# EAGLE schematic esp32-Prototipo (EAGLE 8.2.2)
CNAME: Simulacare; CREVISION: 1.0.0; DESIGNER: Rinaldo; UNTITLED: Board ESP32
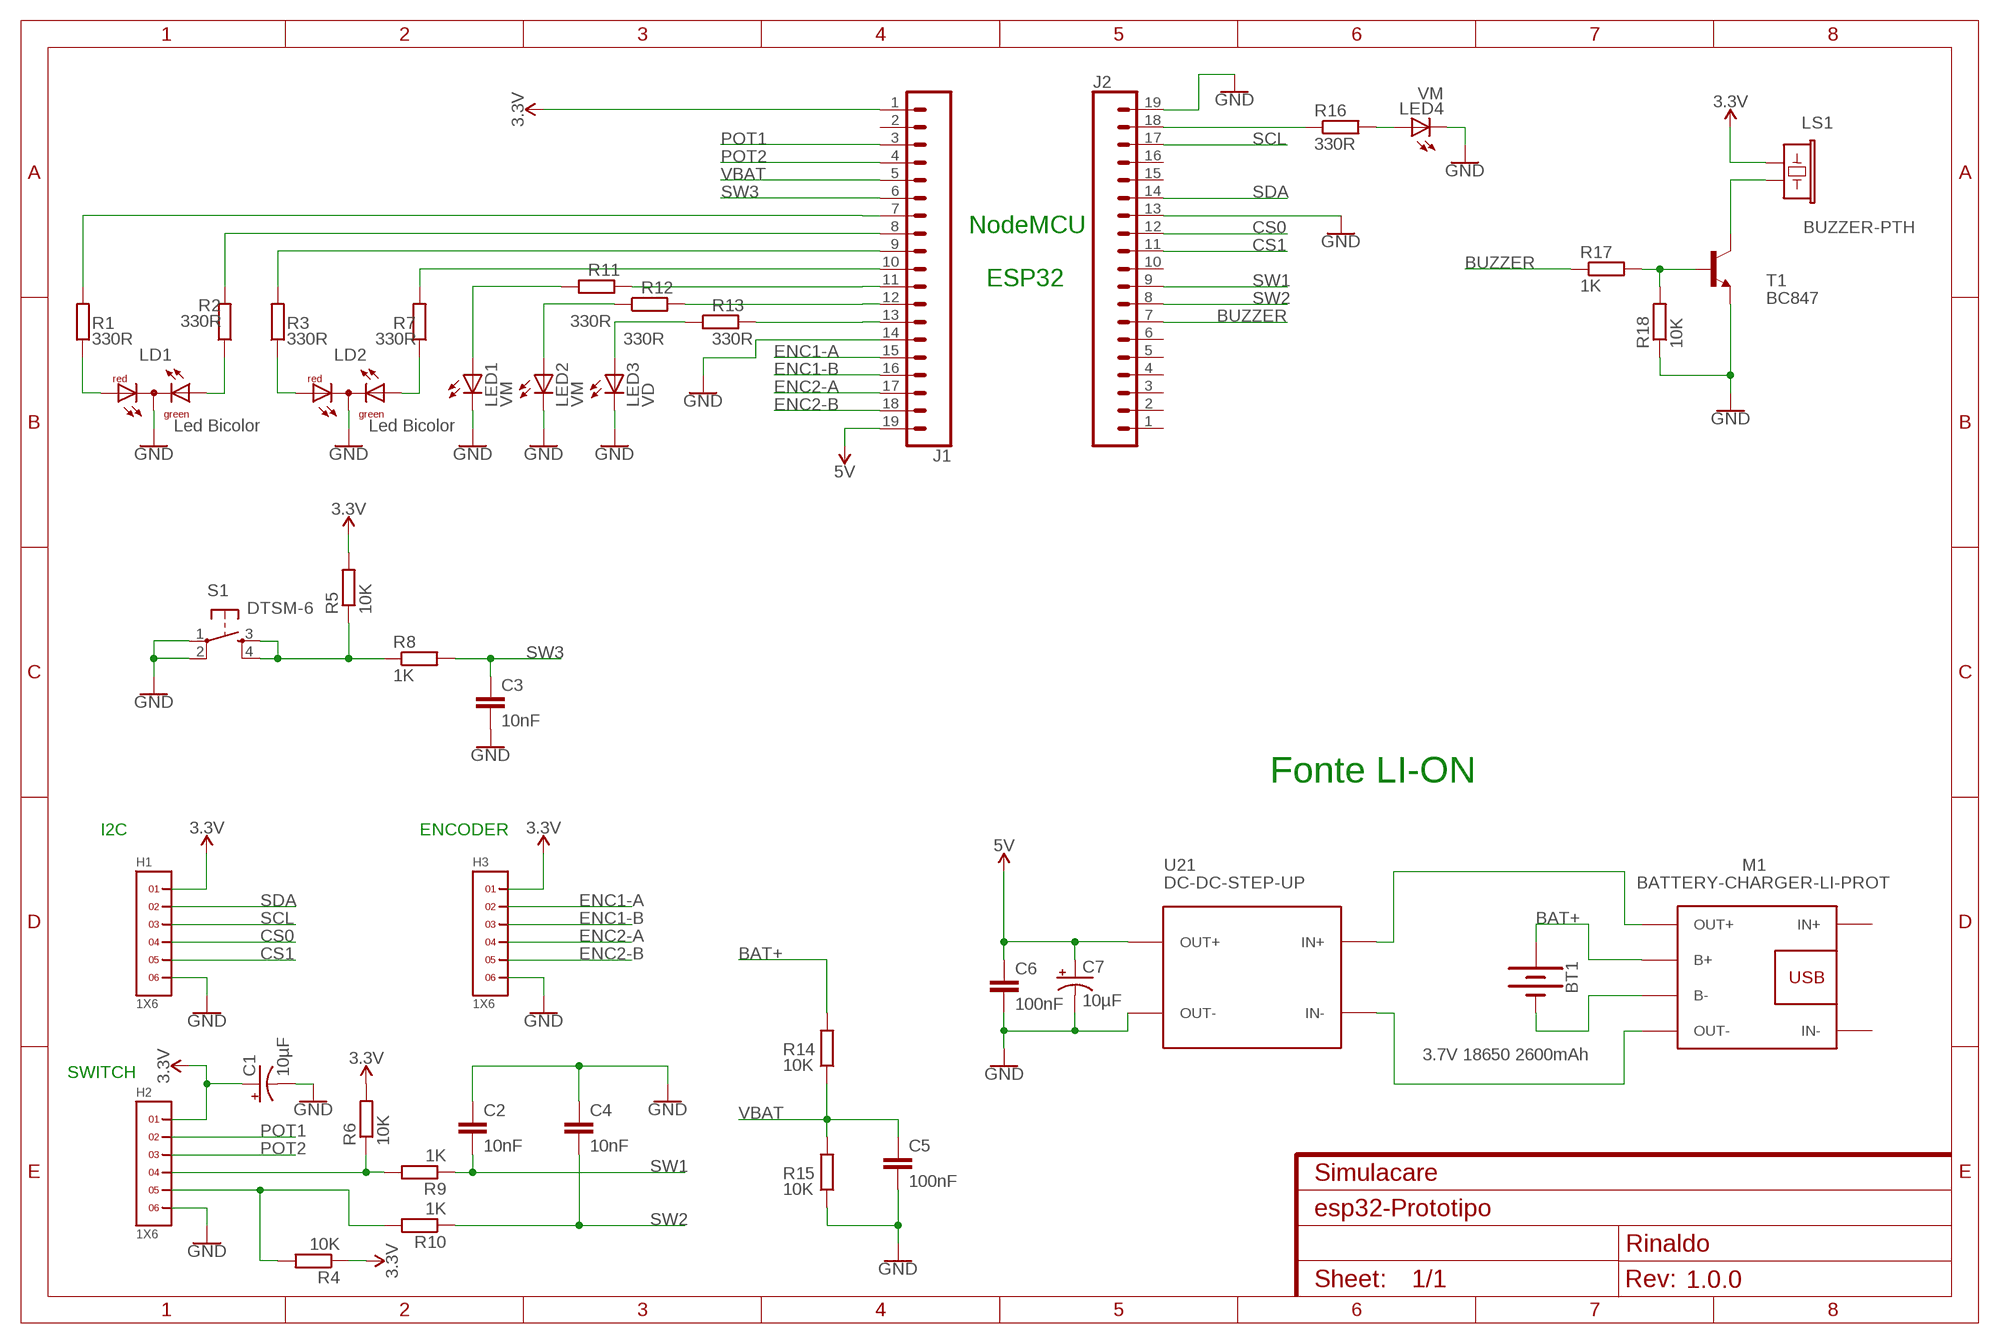
[diagram p0: schematic, sheet 1]

## Parts
BT1  3.7V 18650 2600mAh  BATTERY-18650  [BATTERY_18650-HOLDER]
C1  10µF  10UF-POLAR-EIA6032-25V-10%  [EIA6032-NOM]
C2  10nF  0.1UF-0603-25V-5%  [0603]
C3  10nF  0.1UF-0603-25V-5%  [0603]
C4  10nF  0.1UF-0603-25V-5%  [0603]
C5  100nF  0.1UF-0603-25V-5%  [0603]
C6  100nF  0.1UF-0603-25V-5%  [0603]
C7  10µF  10UF-POLAR-EIA6032-25V-10%  [EIA6032-NOM]
H1  1X6  [1X6]
H2  1X6  [1X6]
H3  1X6  [1X6]
J1  CONN_19  [1X19]
J2  CONN_19  [1X19]
LD1  Led Bicolor  DUOLED-RG-C  [DUOLED-C-5MM]
LD2  Led Bicolor  DUOLED-RG-C  [DUOLED-C-5MM]
LED1  VM  LED5MM  [LED5MM]
LED2  VM  LED5MM  [LED5MM]
LED3  VD  LED5MM  [LED5MM]
LED4  VM  LED5MM  [LED5MM]
LS1  BUZZER-PTH  [BUZZER-12MM]
M1  BATTERY-CHARGER-LI-PROT  [BATTERY-CHARGER-LI-PROT]
R1  330R  R-EU_R0603  [R0603]
R2  330R  R-EU_R0603  [R0603]
R3  330R  R-EU_R0603  [R0603]
R4  10K  R-EU_R0603  [R0603]
R5  10K  R-EU_R0603  [R0603]
R6  10K  R-EU_R0603  [R0603]
R7  330R  R-EU_R0603  [R0603]
R8  1K  R-EU_R0603  [R0603]
R9  1K  R-EU_R0603  [R0603]
R10  1K  R-EU_R0603  [R0603]
R11  330R  R-EU_R0603  [R0603]
R12  330R  R-EU_R0603  [R0603]
R13  330R  R-EU_R0603  [R0603]
R14  10K  R-EU_R0603  [R0603]
R15  10K  R-EU_R0603  [R0603]
R16  330R  R-EU_R0603  [R0603]
R17  1K  R-EU_R0603  [R0603]
R18  10K  R-EU_R0603  [R0603]
S1  DTSM-6  [DTSM-6]
T1  BC847  [SOT23]
U21  DC-DC-STEP-UP  DC-DC-STEP-UP-MT3608  [DC-DC-STEP-UP-MT3608]

## Nets
3.3V: C1.A(+) H1.1 H2.1 H3.1 J1.1 LS1.+ R4.1 R5.2 R6.2
5V: C6.1 C7.A(+) J1.19 U21.OUT+
BAT+: BT1.PWR@1(+) M1.B+ R14.2
BUZZER: J2.7 R17.1
CS0: H1.4 J2.12
CS1: H1.5 J2.11
ENC1-A: H3.2 J1.15
ENC1-B: H3.3 J1.16
ENC2-A: H3.4 J1.17
ENC2-B: H3.5 J1.18
GND: C1.C(-) C2.1 C3.2 C4.1 C5.2 C6.2 C7.C(-) H1.6 H2.6 H3.6 J1.14 J2.13 J2.19 LD1.C LD2.C LED1.K(C) LED2.K(C) LED3.K(C) LED4.K(C) R15.1 R18.1 S1.1 S1.2 T1.2(E) U21.OUT-
N$2: J1.13 R13.2
N$3: J1.12 R12.2
N$4: J1.11 R11.2
N$5: LED3.A R13.1
N$6: LED2.A R12.1
N$7: LED1.A R11.1
N$8: LD1.AR R1.1
N$9: LD1.AX(AG) R2.1
N$10: J1.7 R1.2
N$11: J1.8 R2.2
N$12: LD2.AR R3.1
N$13: LD2.AX(AG) R7.1
N$14: J1.9 R3.2
N$15: J1.10 R7.2
N$16: J2.18 R16.1
N$17: LED4.A R16.2
N$20: BT1.GND@1(-) M1.B-
N$21: LS1.- T1.3(C)
N$22: R17.2 R18.2 T1.1(B)
N$24: R5.1 R8.1 S1.3 S1.4
N$25: H2.4 R6.1 R9.2
N$26: H2.5 R4.2 R10.2
N$29: M1.OUT- U21.IN-
N$30: M1.OUT+ U21.IN+
POT1: H2.2 J1.3
POT2: H2.3 J1.4
SCL: H1.3 J2.17
SDA: H1.2 J2.14
SW1: C2.2 J2.9 R9.1
SW2: C4.2 J2.8 R10.1
SW3: C3.1 J1.6 R8.2
VBAT: C5.1 J1.5 R14.1 R15.2
Unconnected: J1.2 J2.1 J2.2 J2.3 J2.4 J2.5 J2.6 J2.10 J2.15 J2.16 M1.IN+ M1.IN-

## Notes on the sheet
- NodeMCU
- ESP32
- Fonte LI-ON
- I2C | ENCODER
- SWITCH

## Library data of the parts
BT1 = SparkFun-Batteries:BATTERY: Battery - Single Cell A variety of battery chemistries, sizes, and footprints. Device List: 20MM_PTH - Coin Cell Battery Holder - 20mm (PTH) <https://www.sparkfun.com/products/783> 6.8MM_PTH - Coin Cell Battery Holder - 6.8MM(SMD) <https://www.digikey.com/product-detail/en/seiko-instruments/MS621FE-FL11E/728-1057-ND/1889208?WT.srch=1&gclid=CNOQ5a6LzdQCFZS2wAodXCkE0g> 12MM_SMD - Coin Cell Battery Holder - 12mm (SMD) <https://www.sparkfun.com/products/10592> 12MM_PTH - Coin Cell Battery Holder - 12mm (PTH) <https://www.sparkfun.com/products/7948> 20MM_SMD - 20mm Coin Cell Battery Holder (SMD) (2 legs) Used on the Big Time Watch Kit <https://www.sparkfun.com/products/11734> 20MM_SMD_4LEGS - Coin Cell Battery Holder - 20mm (SMD) <https://www.sparkfun.com/products/11892> 20MM_SMD_4LEGS_OVERPASTE - Coin Cell Battery Holder - 20mm (SMD) <https://www.sparkfun.com/products/11892> (Over-paste on the legs) 24.5MM_PTH - Coin Cell Battery Holder - 24.5mm (PTH) <https://www.sparkfun.com/products/8863> 9V - 9V Battery Holder - PC Mount Used on the SparkFun SparkPunk Sound Kit <https://www.sparkfun.com/products/11177> and SparkFun SparkPunk Sequencer Kit <https://www.sparkfun.com/products/12707> 18650 - Battery Holder - 18650 (PTH) <https://www.sparkfun.com/products/13113> AA - Battery Holder - 1xAA (PTH) <https://www.sparkfun.com/products/7949> AAA - Battery Holder - 1xAAA (PTH) <https://www.sparkfun.com/products/12718> AA_KIT - Battery Holder - 1xAA (PTH) <https://www.sparkfun.com/products/7949> Special kit package - pads only have exposed copper on one side of the board. AAA_KIT - Battery Holder - 1xAAA (PTH) <https://www.sparkfun.com/products/12718> Special kit package - pads only have exposed copper on one side of the board.; PROD_ID: BATT-12327; SF_SKU: PRT-13113
C1 C7 = SparkFun-Capacitors:10UF-POLAR: 10.0µF polarized capacitors A capacitor is a passive two-terminal electrical component used to store electrical energy temporarily in an electric field.; PROD_ID: CAP-12984
C2-C6 = SparkFun-Capacitors:0.1UF: 0.1µF ceramic capacitors A capacitor is a passive two-terminal electrical component used to store electrical energy temporarily in an electric field.; PROD_ID: CAP-08604; VALUE: 0.1uF
H1-H3 = header:1X6
J1 J2 = SparkFun-Connectors:CONN_19: Multi connection point. Often used as Generic Header-pin footprint for 0.1 inch spaced/style header connections On any of the 0.1 inch spaced packages, you can populate with these: Break Away Headers - Straight <https://www.sparkfun.com/products/116> (PRT-00116) Break Away Male Headers - Right Angle <https://www.sparkfun.com/products/553> (PRT-00553) Female Headers <https://www.sparkfun.com/products/115> (PRT-00115) Break Away Headers - Machine Pin <https://www.sparkfun.com/products/117> (PRT-00117) Break Away Female Headers - Swiss Machine Pin <https://www.sparkfun.com/products/743> (PRT-00743) For SCREWTERMINALS and SPRING TERMINALS visit here: Screw Terimnals on SparkFun.com <https://www.sparkfun.com/search/results?term=Screw+Terminals> (5mm/3.5mm/2.54mm spacing) This device is also useful as a general connection point to wire up your design to another part of your project. Our various solder wires solder well into these plated through hole pads. Hook-Up Wire - Assortment (Stranded, 22 AWG) <https://www.sparkfun.com/products/11375> (PRT-11375) Hook-Up Wire - Assortment (Solid Core, 22 AWG) <https://www.sparkfun.com/products/11367> (PRT-11367) View the entire wire category on our website here <https://www.sparkfun.com/categories/141> Special notes: Molex polarized connector foot print use with SKU : PRT-08231 with associated crimp pins and housings. 1MM SMD Version SKU: PRT-10208 NOTES ON THE VARIANTS LOCK and LOCK_LONGPADS... This footprint was designed to help hold the alignment of a through-hole component (i.e. 6-pin header) while soldering it into place. You may notice that each hole has been shifted either up or down by 0.005 of an inch from it's more standard position (which is a perfectly straight line). This slight alteration caused the pins (the squares in the middle) to touch the edges of the holes. Because they are alternating, it causes a "brace" to hold the component in place. 0.005 has proven to be the perfect amount of "off-center" position when using our standard breakaway headers. Although looks a little odd when you look at the bare footprint, once you have a header in there, the alteration is very hard to notice. Also,if you push a header all the way into place, it is covered up entirely on the bottom side.
LD1 LD2 = led:DUOLED-RG-C: DUO LED 2 colors (red/green), 5 mm, round, common Cathode www.ligitek.com or other producers.
LED1-LED4 = adafruit:LED: LED OSRAM: - CHIPLED LG R971, LG N971, LY N971, LG Q971, LY Q971, LO R971, LY R971 LH N974, LH R974 LS Q976, LO Q976, LY Q976 LO Q996 - Hyper CHIPLED LW Q18S LB Q993, LB Q99A, LB R99A - SideLED LS A670, LO A670, LY A670, LG A670, LP A670 LB A673, LV A673, LT A673, LW A673 LH A674 LY A675 LS A676, LA A676, LO A676, LY A676, LW A676 LS A679, LY A679, LG A679 - Hyper Micro SIDELED® LS Y876, LA Y876, LO Y876, LY Y876 LT Y87S - SmartLED LW L88C, LW L88S LB L89C, LB L89S, LG L890 LS L89K, LO L89K, LY L89K LS L896, LA L896, LO L896, LY L896 - TOPLED LS T670, LO T670, LY T670, LG T670, LP T670 LSG T670, LSP T670, LSY T670, LOP T670, LYG T670 LG T671, LOG T671, LSG T671 LB T673, LV T673, LT T673, LW T673 LH T674 LS T676, LA T676, LO T676, LY T676, LB T676, LH T676, LSB T676, LW T676 LB T67C, LV T67C, LT T67C, LS T67K, LO T67K, LY T67K, LW E67C LS E67B, LA E67B, LO E67B, LY E67B, LB E67C, LV E67C, LT E67C LW T67C LS T679, LY T679, LG T679 LS T770, LO T770, LY T770, LG T770, LP T770 LB T773, LV T773, LT T773, LW T773 LH T774 LS E675, LA E675, LY E675, LS T675 LS T776, LA T776, LO T776, LY T776, LB T776 LHGB T686 LT T68C, LB T68C - Hyper Mini TOPLED® LB M676 - Mini TOPLED Santana® LG M470 LS M47K, LO M47K, LY M47K Source: http://www.osram.convergy.de/
LS1 = SparkFun-Electromechanical:BUZZER: Buzzer Small round buzzers that operate around the audible 2kHz range. You can use these as speakers to create simple music or user interfaces. Variant Overview: PTH - Mini Speaker - PC Mount 12mm 2.048kHz <https://www.sparkfun.com/products/7950> PTH_KIT - Mini Speaker - PC Mount 12mm 2.048kHz <https://www.sparkfun.com/products/7950> KIT simplifies soldering by adding stop mask to one side of the pads. PTH_NO_SILK - Mini Speaker - PC Mount 12mm 2.048kHz <https://www.sparkfun.com/products/7950> No silkscreen indicator of buzzer outline. PTH_KIT_NO_SILK - Mini Speaker - PC Mount 12mm 2.048kHz <https://www.sparkfun.com/products/7950> KIT package w/o silkscreen SMD - Buzzer Audio Magnetic (CCV-084B16) SMD buzzer used on, e.g. the LilyPad Buzzer <https://www.sparkfun.com/products/8463> and RFID USB Reader <https://www.sparkfun.com/products/9963>. SMD_KIT - Buzzer Audio Magnetic (CCV-084B16) SMD Buzzer with elongated pins to make soldering easier. Used on the SparkFun Simon Says - Surface Mount Soldering Kit <https://www.sparkfun.com/products/10935>.; PROD_ID: COMP-08253; SF_SKU: COM-07950
M1 = diy-modules:BATTERY-CHARGER-LI-PROT: Lithium Battery 5V Charger with protection circuit More details available here: http://www.instructables.com/id/DIY-Lithium-ion-Battery-Charger/step4/TP4056-based-lithium-ion-battery-charger-module/ Click here to find device on ebay.com <http://www.ebay.com/sch/tp4056+charger+usb+protection>
R1-R18 = resistor:R-EU_: RESISTOR, European symbol
S1 = switch-tact:DTSM-6
T1 = transistor:BC847: NPN TRANSISTOR
U21 = diy-modules:DC-DC-STEP-UP-MT3608: DC/DC Step-Up Regulator based on MT3608 chip MT3608 datasheet available here: https://www.olimex.com/Products/Breadboarding/BB-PWR-3608/resources/MT3608.pdf Click here to find device on ebay.com <http://www.ebay.com/sch/mt3608+module>